# Altium project roomlamp.PrjPcb
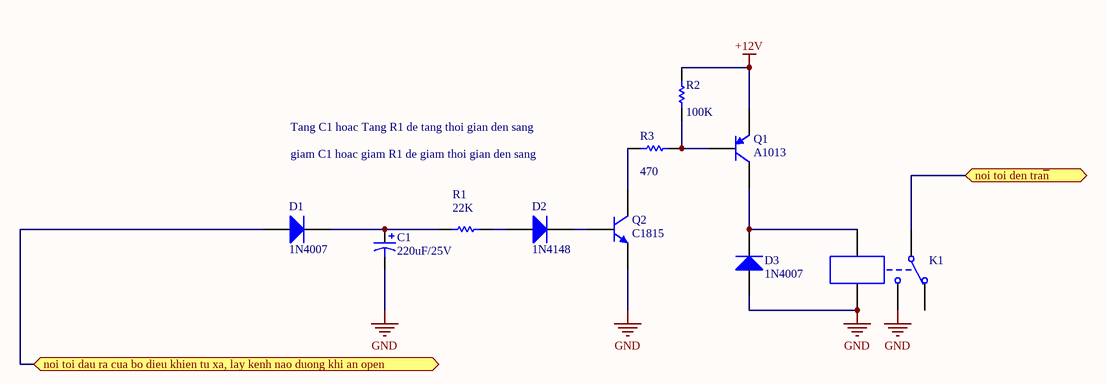
[diagram p0: Sheet1.SchDoc]
2 sheets, 13 parts. Net scope: flat (ports and power ports of the same name join across sheets).
Sheets:
  Sheet1.SchDoc
  Sheet2.SchDoc

## Sheet Sheet1.SchDoc
size A

### Parts
(Parts that share a designator on the sheet are numbered #1, #2 ... from top to bottom, then left to right.)
C1#1  220uF/25V  [RB7.6-15]
D1  1N4007  [DO-41]
D2  1N4148  [DO-35]
D3  1N4007  [DO-41]
K1  (no value)  [MODULE5B]
Q1  A1013  [SOT-23B_N]
Q2  C1815  [TO-226-AA]
R1  value 22K  [AXIAL-0.3]
R2  value 100K  [AXIAL-0.3]
R3  value 470  [AXIAL-0.3]

### Ports
noi toi dau ra cua bo dieu khien tu xa, lay kenh nao duong khi an open, noi toi den tra~{n}

### Nets
+12V: Q1.3(E) R2.2
GND: C1#1.2 D3.1(A) K1.3 K1.5 Q2.3(E)
NetC1#1_1: C1#1.1 D1.2(K) R1.2
NetD1_1: D1.1(A) ; port noi toi dau ra cua bo dieu khien tu xa, lay kenh nao duong khi an open
NetD2_1: D2.1(A) R1.1
NetD2_2: D2.2(K) Q2.2(B)
NetD3_2: D3.2(K) K1.4 Q1.1(C)
NetK1_1: K1.1 ; port noi toi den tra~{n}
NetQ1_2: Q1.2(B) R2.1 R3.1
NetQ2_1: Q2.1(C) R3.2

Not connected (* = marked no-connect by the designer): K1 2

### Notes on the sheet
- Tang C1 hoac Tang R1 de tang thoi gian den sang
- giam C1 hoac giam R1 de giam thoi gian den sang

### Library data of the parts
C1#1 = Cap Pol1: Polarized Capacitor (Radial); Published: 8-Jun-2000; LatestRevisionDate: 17-Jul-2002; LatestRevisionNote: Re-released for DXP Platform.; PackageReference: RB7.6-15; Publisher: Altium Limited; PackageDescription: Polarized Capacitor (Radial); 2 Leads
D1 D3 = Diode 1N4007: 1 Amp General Purpose Rectifier; Published: 8-Jun-2000; LatestRevisionDate: 17-Jul-2002; LatestRevisionNote: Re-released for DXP Platform.; DatasheetVersion: 1998; PackageVersion: Aug-1999; PackageReference: DO-41; Publisher: Altium Limited; PackageDescription: Diode, Axial; Body 5.2 x 2.7 mm (LxDia. max), Lead Dia. 0.86 mm (max); Code_JEDEC: DO-204-AL; ComponentLink1Description: Manufacturer Link; ComponentLink1URL: http://www.fairchildsemi.com/; ComponentLink2Description: Datasheet; ComponentLink2URL: http://www.fairchildsemi.com/ds/1N%2F1N4001.pdf
D2 = Diode 1N4148: High Conductance Fast Diode; Published: 8-Jun-2000; LatestRevisionDate: 17-Jul-2002; LatestRevisionNote: Re-released for DXP Platform.; DatasheetVersion: 1997; PackageReference: DO-35; Publisher: Altium Limited; PackageDescription: Diode, Axial; Body 3.8 x 1.9 mm (LxDia. max), Lead Dia. 0.53 mm (max); Code_JEDEC: DO-204-AH; ComponentLink1Description: Manufacturer Link; ComponentLink1URL: http://www.fairchildsemi.com/; ComponentLink2Description: Datasheet; ComponentLink2URL: http://www.fairchildsemi.com/ds/1N%2F1N4148.pdf
K1 = Relay-SPDT: Single-Pole Dual-Throw Relay; Published: 24-Mar-1999; LatestRevisionDate: 17-Jul-2002; LatestRevisionNote: Re-released for DXP Platform.; PackageReference: MODULE5B; Publisher: Altium Limited
Q1 = PNP: PNP Bipolar Transistor; Published: 8-Jun-2000; LatestRevisionDate: 29-May-2009; LatestRevisionNote: IPC-7351 Footprint Added.; PackageVersion: Aug-1999; PackageReference: SOT-23B; Publisher: Altium Limited; PackageDescription: 3-Pin SOT-23 Package 0.95 mm Pitch, 2.4 mm Lead Span
Q2 = NPN: NPN Bipolar Transistor; Published: 8-Jun-2000; LatestRevisionDate: 17-Jul-2002; LatestRevisionNote: Re-released for DXP Platform.; PackageReference: TO-226-AA; Publisher: Altium Limited; PackageDescription: TO, Flat Index; 3 In-Line, Axial Leads; Body Dia. 4.8mm; Leads 0.55 x 0.51 mm (max); Code_JEDEC: TO-226-AA
R1-R3 = Res1: Resistor; Published: 8-Jun-2000; LatestRevisionDate: 17-Jul-2002; LatestRevisionNote: Re-released for DXP Platform.; PackageReference: AXIAL-0.3; Publisher: Altium Limited; PackageDescription: Axial Device, Thru-Hole; 2 Leads; 0.3 in Pin Spacing

## Sheet Sheet2.SchDoc
size A
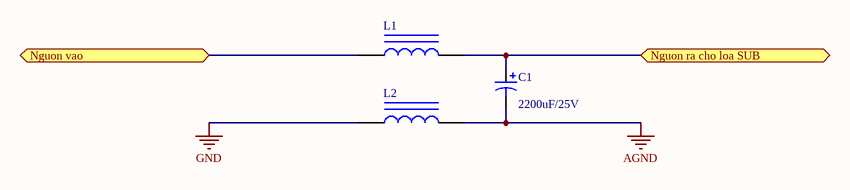
[diagram p1: Sheet2.SchDoc]

### Parts
(Parts that share a designator on the sheet are numbered #1, #2 ... from top to bottom, then left to right.)
C1#2  value 2200uF/25V  [RB7.6-15]
L1  (no value)  [AXIAL-0.9]
L2  (no value)  [AXIAL-0.9]

### Ports
Nguon ra cho loa SUB, Nguon vao

### Nets
AGND: C1#2.2 L2.2
GND: L2.1
NetC1#2_1: C1#2.1 L1.2 ; port Nguon ra cho loa SUB
NetL1_1: L1.1 ; port Nguon vao

### Library data of the parts
C1#2 = Cap Pol1: Polarized Capacitor (Radial); Published: 8-Jun-2000; LatestRevisionDate: 17-Jul-2002; LatestRevisionNote: Re-released for DXP Platform.; PackageReference: RB7.6-15; Publisher: Altium Limited; PackageDescription: Polarized Capacitor (Radial); 2 Leads
L1 L2 = Inductor Iron: Magnetic-Core Inductor; Published: 24-Mar-1999; LatestRevisionDate: 17-Jul-2002; LatestRevisionNote: Re-released for DXP Platform.; PackageReference: AXIAL-0.9; Publisher: Altium Limited; PackageDescription: Axial Device, Thru-Hole; 2 Leads; 0.9 in Pin Spacing

## Nets that join several sheets
GND: Sheet1 (5 pins), Sheet2 (L2.1)